# EAGLE design CSv2_exp_board (EAGLE 9.6.2)
COMPANY: ADAFRUIT INDUSTRIES; DRAWN: KTOWN; REV: B

## Sheet 1 of 3
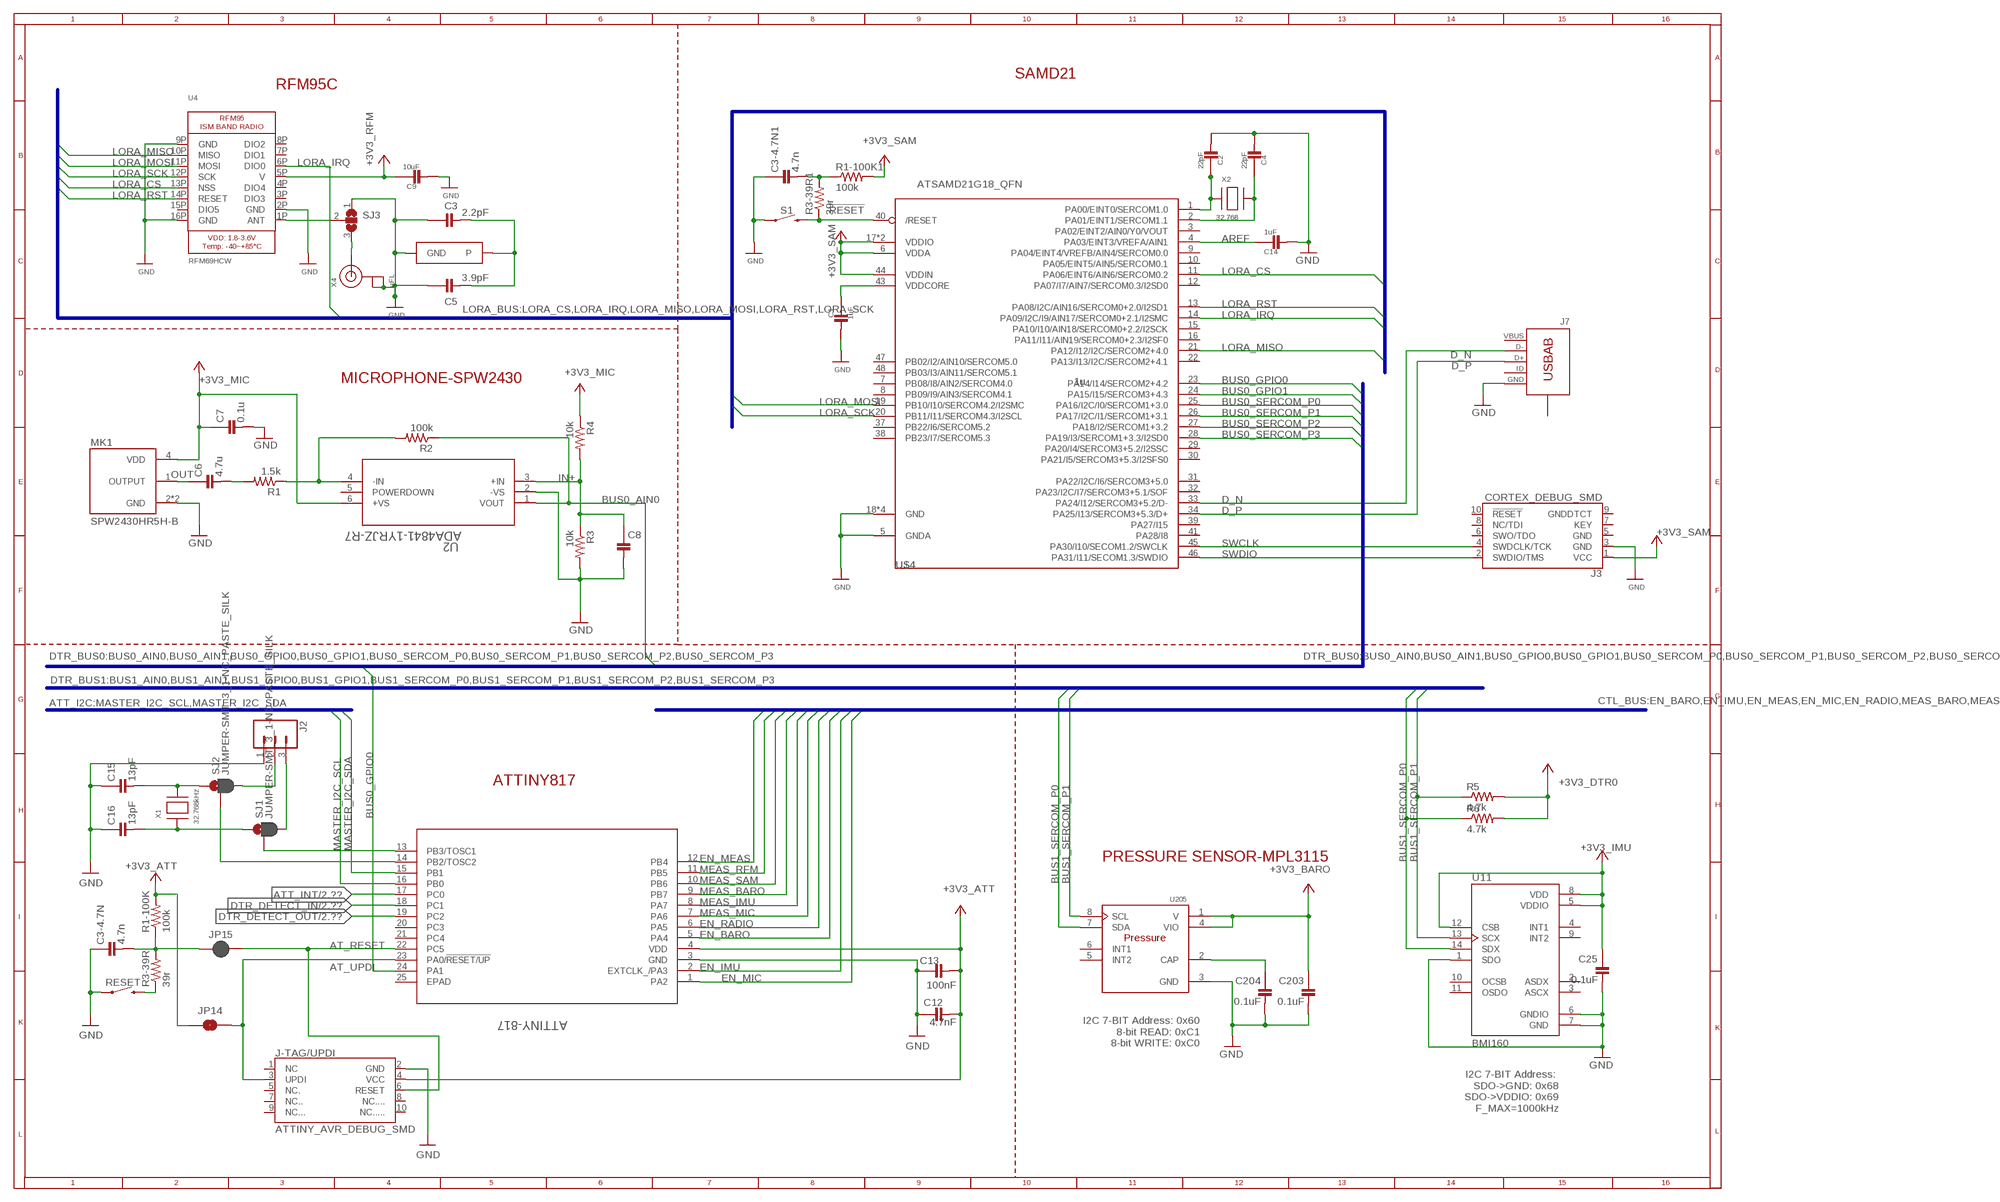
[diagram p0: schematic, sheet 1, part 1 of 2]
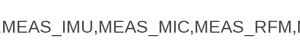
[diagram p1: schematic, sheet 1, part 2 of 2]

### Parts
ATTINY-817  ATTINY817-MFRQFN24_RX4MC-L_ATTINY817-MFR  [ATTINY817-MFRQFN24_RX4MC-L_QFN24_4X4MC]
C1  1uF  C-0603  [C0603]
C2  22pF  C-0603  [C0603]
C3  2.2pF  C-0402  [C0402]
C3-4.7N  4.7n  C-0603  [C0603]
C3-4.7N1  4.7n  C-0603  [C0603]
C4  22pF  C-0603  [C0603]
C5  3.9pF  C-0402  [C0402]
C6  4.7u  C-0603  [C0603]
C7  0.1u  C-0603  [C0603]
C8  1u  C-0603  [C0603]
C9  10uF  C-0805  [C0805]
C12  4.7nF  C-0603  [C0603]
C13  100nF  C-0402  [C0402]
C14  1uF  C-0603  [C0603]
C15  13pF  C-0402  [C0402]
C16  13pF  C-0402  [C0402]
C25  0.1uF  C-0603  [C0603]
C203  0.1uF  C-0603  [C0603]
C204  0.1uF  C-0603  [C0603]
J2  J-SCR-3SL  [SCR-3.5MM-3]
J3  CORTEX_DEBUG_SMD  [SAMTECH_FTSH-105-01]
J7  J-USB-HIROSE-MICRO-USB  [USB-THRU-ZX62D-AB-5P8]
J-TAG/UPDI  ATTINY_AVR_DEBUG_SMD  [ATTINY_AVR_DEBUG]
JP14  JUMPER-SMT_2_NO_PASTEFREE  [SMT-JUMPER_2_NO_PASTEFREE_NO-SILK]
JP15  JUMPER-SMT_2_NC_PASTE  [SMT-JUMPER_2_LG_NC_PASTE_NO-SILK]
MK1  SPW2430HR5H-B  [MIC_SPW2430HR5H-B]
R1  1.5k  R-0603  [R0603]
R1-100K  100k  R-0603  [R0603]
R1-100K1  100k  R-0603  [R0603]
R2  100k  R-0603  [R0603]
R3  10k  R-0603  [R0603]
R3-39R  39r  R-0603  [R0603]
R3-39R1  39r  R-0603  [R0603]
R4  10k  R-0603  [R0603]
R5  4.7k  R-0805  [R0805]
R6  4.7k  R-0805  [R0805]
RESET  MOMENTARY-SWITCH-SPST-SMD-5.2MM  [TACTILE_SWITCH_SMD_5.2MM]
S1  MOMENTARY-SWITCH-SPST-SMD-5.2MM  [TACTILE_SWITCH_SMD_5.2MM]
SJ1  JUMPER-SMT_3_1-NC_PASTE_SILK  [SMT-JUMPER_3_1-NC_PASTE_SILK]
SJ2  JUMPER-SMT_3_1-NC_PASTE_SILK  [SMT-JUMPER_3_1-NC_PASTE_SILK]
SJ3  JUMPER_SJ2W  [JUMPER_SJ_2]
U2  ADA4841-1YRJZ-R7  [RJ_6]
U4  RFM69HCW  RFM95C  [RFM-MOD]
U11  BMI160  [PQFN50P300X250X88-14N]
U205  MPL3115A2  [MPL3115A2_PSON125P300X500X120-8N]
U$1  ILA09_CHIP_ANTENNASMD  [ILA_09_CHIP_ANTENNA]
U$4  ATSAMD21G18_QFN  MICROBUILDER_ATSAMD21J_QFN  [MICROBUILDER_TQFN48_7MM]
X1  32.768kHz  ADAFRUIT2_XTAL-3.2X1.5  [ADAFRUIT2_XTAL3215]
X2  32.768  ADAFRUIT2_XTAL-3.2X1.5  [ADAFRUIT2_XTAL3215]
X4  uFL  J-U.FL  [U.FL]

### Nets
!RESET: R3-39R1.1 S1.3 U$4.40(/RESET)
+3V3_ATT [power]: ATTINY-817.4(VDD) C12.2 C13.2 J-TAG/UPDI.4(VCC) JP14.1 R1-100K.2 ; supply symbol labelled +3V3 ; also sheet 2
+3V3_BARO [power]: C203.1 U205.1(V) U205.4(VIO) ; supply symbol labelled +3V3 ; also sheet 2
+3V3_DTR0 [power]: R5.2 R6.2 ; supply symbol labelled +3V3 ; also sheet 2
+3V3_IMU: C25.1 U11.5(VDDIO) U11.8(VDD) U11.12(CSB) ; supply symbol labelled +3V3 ; also sheet 2
+3V3_MIC: C7.1 MK1.4(VDD) R4.1 U2.6(+VS) ; supply symbol labelled +3V3 ; also sheet 2
+3V3_RFM [power]: C9.1 U4.5P(V) ; supply symbol labelled +3V3 ; also sheet 2
+3V3_SAM: J3.1(VCC) R1-100K1.2 U$4.6(VDDA) U$4.17(VDDIO) U$4.36(VDDIO) U$4.44(VDDIN) ; supply symbol labelled +3V3 ; also sheet 2
AREF: C14.1 U$4.4(PA03/EINT3/VREFA/AIN1)
AT_RESET: ATTINY-817.22(PC5) J-TAG/UPDI.6(RESET) JP15.2
AT_UPDI: ATTINY-817.23(PA0/!RESET/UP) J-TAG/UPDI.3(UPDI) JP14.2
ATT_INT: ATTINY-817.17(PC0) ; also sheet 2
BUS0_AIN0: R2.1 U2.1(VOUT) ; also sheet 2
BUS0_GPIO0: ATTINY-817.24(PA1) U$4.23(PA14/I14/SERCOM2+4.2) ; also sheet 2
BUS0_GPIO1: U$4.24(PA15/I15/SERCOM3+4.3) ; also sheet 2
BUS0_SERCOM_P0: U$4.25(PA16/I2C/I0/SERCOM1+3.0) ; also sheet 2
BUS0_SERCOM_P1: U$4.26(PA17/I2C/I1/SERCOM1+3.1) ; also sheet 2
BUS0_SERCOM_P2: U$4.27(PA18/I2/SERCOM1+3.2) ; also sheet 2
BUS0_SERCOM_P3: U$4.28(PA19/I3/SERCOM1+3.3/I2SD0) ; also sheet 2
BUS1_SERCOM_P0: R6.1 U11.14(SDX) U205.7(SDA) ; also sheet 2
BUS1_SERCOM_P1: R5.1 U11.13(SCX) U205.8(SCL) ; also sheet 2
D_N [diff_pair]: J7.D- U$4.33(PA24/I12/SERCOM3+5.2/D-)
D_P [diff_pair]: J7.D+ U$4.34(PA25/I13/SERCOM3+5.3/D+)
DTR_DETECT_IN: ATTINY-817.18(PC1) ; also sheet 2
DTR_DETECT_OUT: ATTINY-817.19(PC2) ; also sheet 2
EN_BARO: ATTINY-817.5(PA4) ; also sheet 2
EN_IMU: ATTINY-817.2(EXTCLK_/PA3) ; also sheet 2
EN_MEAS: ATTINY-817.12(PB4) ; also sheet 2
EN_MIC: ATTINY-817.1(PA2) ; also sheet 2
EN_RADIO: ATTINY-817.6(PA5) ; also sheet 2
GND: ATTINY-817.3(GND) C1.2 C2.2 C3-4.7N1.1 C3-4.7N.1 C3.1 C4.2 C5.1 C7.2 C8.2 C9.2 C12.1 C13.1 C14.2 C15.1 C16.1 C25.2 C203.2 C204.2 J2.1 J3.3(GND) J7.GND J-TAG/UPDI.2(GND) MK1.2(GND) MK1.3(GND) R3.2 RESET.1 S1.1 SJ3.1 U2.2(-VS) U4.2P(GND) U4.9P(GND) U4.16P(GND) U11.1(SDO) U11.6(GNDIO) U11.7(GND) U205.3(GND) U$1.GND U$4.5(GNDA) U$4.18(GND) U$4.35(GND) U$4.42(GND) U$4.THERMAL(GND) X4.1(GND) X4.2(GND) ; also sheet 2
IN+: C8.1 R3.1 R4.2 U2.3(+IN)
IN-: R1.1 R2.2 U2.4(-IN)
LORA_CS: U4.13P(NSS) U$4.11(PA06/EINT6/AIN6/SERCOM0.2)
LORA_IRQ: U4.6P(DIO0) U$4.14(PA09/I2C/I9/AIN17/SERCOM0+2.1/I2SMC)
LORA_MISO: U4.10P(MISO) U$4.21(PA12/I12/I2C/SERCOM2+4.0)
LORA_MOSI: U4.11P(MOSI) U$4.19(PB10/I10/SERCOM4.2/I2SMC)
LORA_RST: U4.14P(RESET) U$4.13(PA08/I2C/AIN16/SERCOM0+2.0/I2SD1)
LORA_SCK: U4.12P(SCK) U$4.20(PB11/I11/SERCOM4.3/I2SCL)
MASTER_I2C_SCL: ATTINY-817.16(PB0) ; also sheet 2
MASTER_I2C_SDA: ATTINY-817.15(PB1) ; also sheet 2
MEAS_BARO: ATTINY-817.9(PB7) ; also sheet 2
MEAS_IMU: ATTINY-817.8(PA7) ; also sheet 2
MEAS_MIC: ATTINY-817.7(PA6) ; also sheet 2
MEAS_RFM: ATTINY-817.11(PB5) ; also sheet 2
MEAS_SAM: ATTINY-817.10(PB6) ; also sheet 2
N$1: C1.1 U$4.43(VDDCORE)
N$2: SJ3.3 X4.3(SIGNAL)
N$5: C2.1 U$4.1(PA00/EINT0/SERCOM1.0) X2.P$1
N$6: C6.2 R1.2
N$7: C4.1 U$4.2(PA01/EINT1/SERCOM1.1) X2.P$2
N$9: C3-4.7N1.2 R1-100K1.1 R3-39R1.2
N$10: C204.1 U205.2(CAP)
N$12: R3-39R.1 RESET.3
N$18: ATTINY-817.13(PB3/TOSC1) SJ1.2
N$19: ATTINY-817.14(PB2/TOSC2) SJ2.2
N$20: J2.2 SJ2.3
N$21: J2.3 SJ1.3
N$22: C16.2 SJ1.1 X1.P$1
N$23: C15.2 SJ2.1 X1.P$2
N$24: C3-4.7N.2 JP15.1 R1-100K.1 R3-39R.2
N$25: C3.2 C5.2 U$1.P
N$26: SJ3.2 U4.1P(ANT)
OUT: C6.1 MK1.1(OUTPUT)
SWCLK: J3.4(SWDCLK/TCK) U$4.45(PA30/I10/SECOM1.2/SWCLK)
SWDIO: J3.2(SWDIO/TMS) U$4.46(PA31/I11/SECOM1.3/SWDIO)
Unconnected: ATTINY-817.20(PC3) ATTINY-817.21(PC4) ATTINY-817.25(EPAD) J3.5(GND) J3.6(SWO/TDO) J3.7(KEY) J3.8(NC/TDI) J3.9(GNDDTCT) J3.10(!RESET) J7.S1(SHIELD) J7.S2(SHIELD) J7.S3(SHIELD) J7.S4(SHIELD) J7.USBID J7.VBUS J-TAG/UPDI.1(NC) J-TAG/UPDI.5(NC.) J-TAG/UPDI.7(NC..) J-TAG/UPDI.8(NC....) J-TAG/UPDI.9(NC...) J-TAG/UPDI.10(NC.....) U4.3P(DIO3) U4.4P(DIO4) U4.7P(DIO1) U4.8P(DIO2) U4.15P(DIO5) U11.2(ASDX) U11.3(ASCX) U11.4(INT1) U11.9(INT2) U11.10(OCSB) U11.11(OSDO) U205.5(INT2) U205.6(INT1) U$4.3(PA02/EINT2/AIN0/Y0/VOUT) U$4.7(PB08/I8/AIN2/SERCOM4.0) U$4.8(PB09/I9/AIN3/SERCOM4.1) U$4.9(PA04/EINT4/VREFB/AIN4/SERCOM0.0) U$4.10(PA05/EINT5/AIN5/SERCOM0.1) U$4.12(PA07/I7/AIN7/SERCOM0.3/I2SD0) U$4.15(PA10/I10/AIN18/SERCOM0+2.2/I2SCK) U$4.16(PA11/I11/AIN19/SERCOM0+2.3/I2SF0) U$4.22(PA13/I13/I2C/SERCOM2+4.1) U$4.29(PA20/I4/SERCOM3+5.2/I2SSC) U$4.30(PA21/I5/SERCOM3+5.3/I2SFS0) U$4.31(PA22/I2C/I6/SERCOM3+5.0) U$4.32(PA23/I2C/I7/SERCOM3+5.1/SOF) U$4.37(PB22/I6/SERCOM5.2) U$4.38(PB23/I7/SERCOM5.3) U$4.39(PA27/I15) U$4.41(PA28/I8) U$4.47(PB02/I2/AIN10/SERCOM5.0) U$4.48(PB03/I3/AIN11/SERCOM5.1)

### Buses
LORA_BUS:LORA_CS,LORA_IRQ,LORA_MISO,LORA_MOSI,LORA_RST,LORA_SCK
ATT_I2C:MASTER_I2C_SCL,MASTER_I2C_SDA
CTL_BUS:EN_BARO,EN_IMU,EN_MEAS,EN_MIC,EN_RADIO,MEAS_BARO,MEAS_IMU,MEAS_MIC,MEAS_RFM,MEAS_SAM
DTR_BUS0:BUS0_AIN0,BUS0_AIN1,BUS0_GPIO0,BUS0_GPIO1,BUS0_SERCOM_P0,BUS0_SERCOM_P1,BUS0_SERCOM_P2,BUS0_SERCOM_P3
DTR_BUS1:BUS1_AIN0,BUS1_AIN1,BUS1_GPIO0,BUS1_GPIO1,BUS1_SERCOM_P0,BUS1_SERCOM_P1,BUS1_SERCOM_P2,BUS1_SERCOM_P3

### Notes on the sheet
- SAMD21
- RFM95C
- MICROPHONE-SPW2430
- ATTINY817
- PRESSURE SENSOR-MPL3115
- I2C 7-BIT Address: 0x60
        8-bit READ: 0xC1
        8-bit WRITE: 0xC0
- I2C 7-BIT Address: 
  SDO->GND: 0x68
  SDO->VDDIO: 0x69
  F_MAX=1000kHz

## Sheet 2 of 3
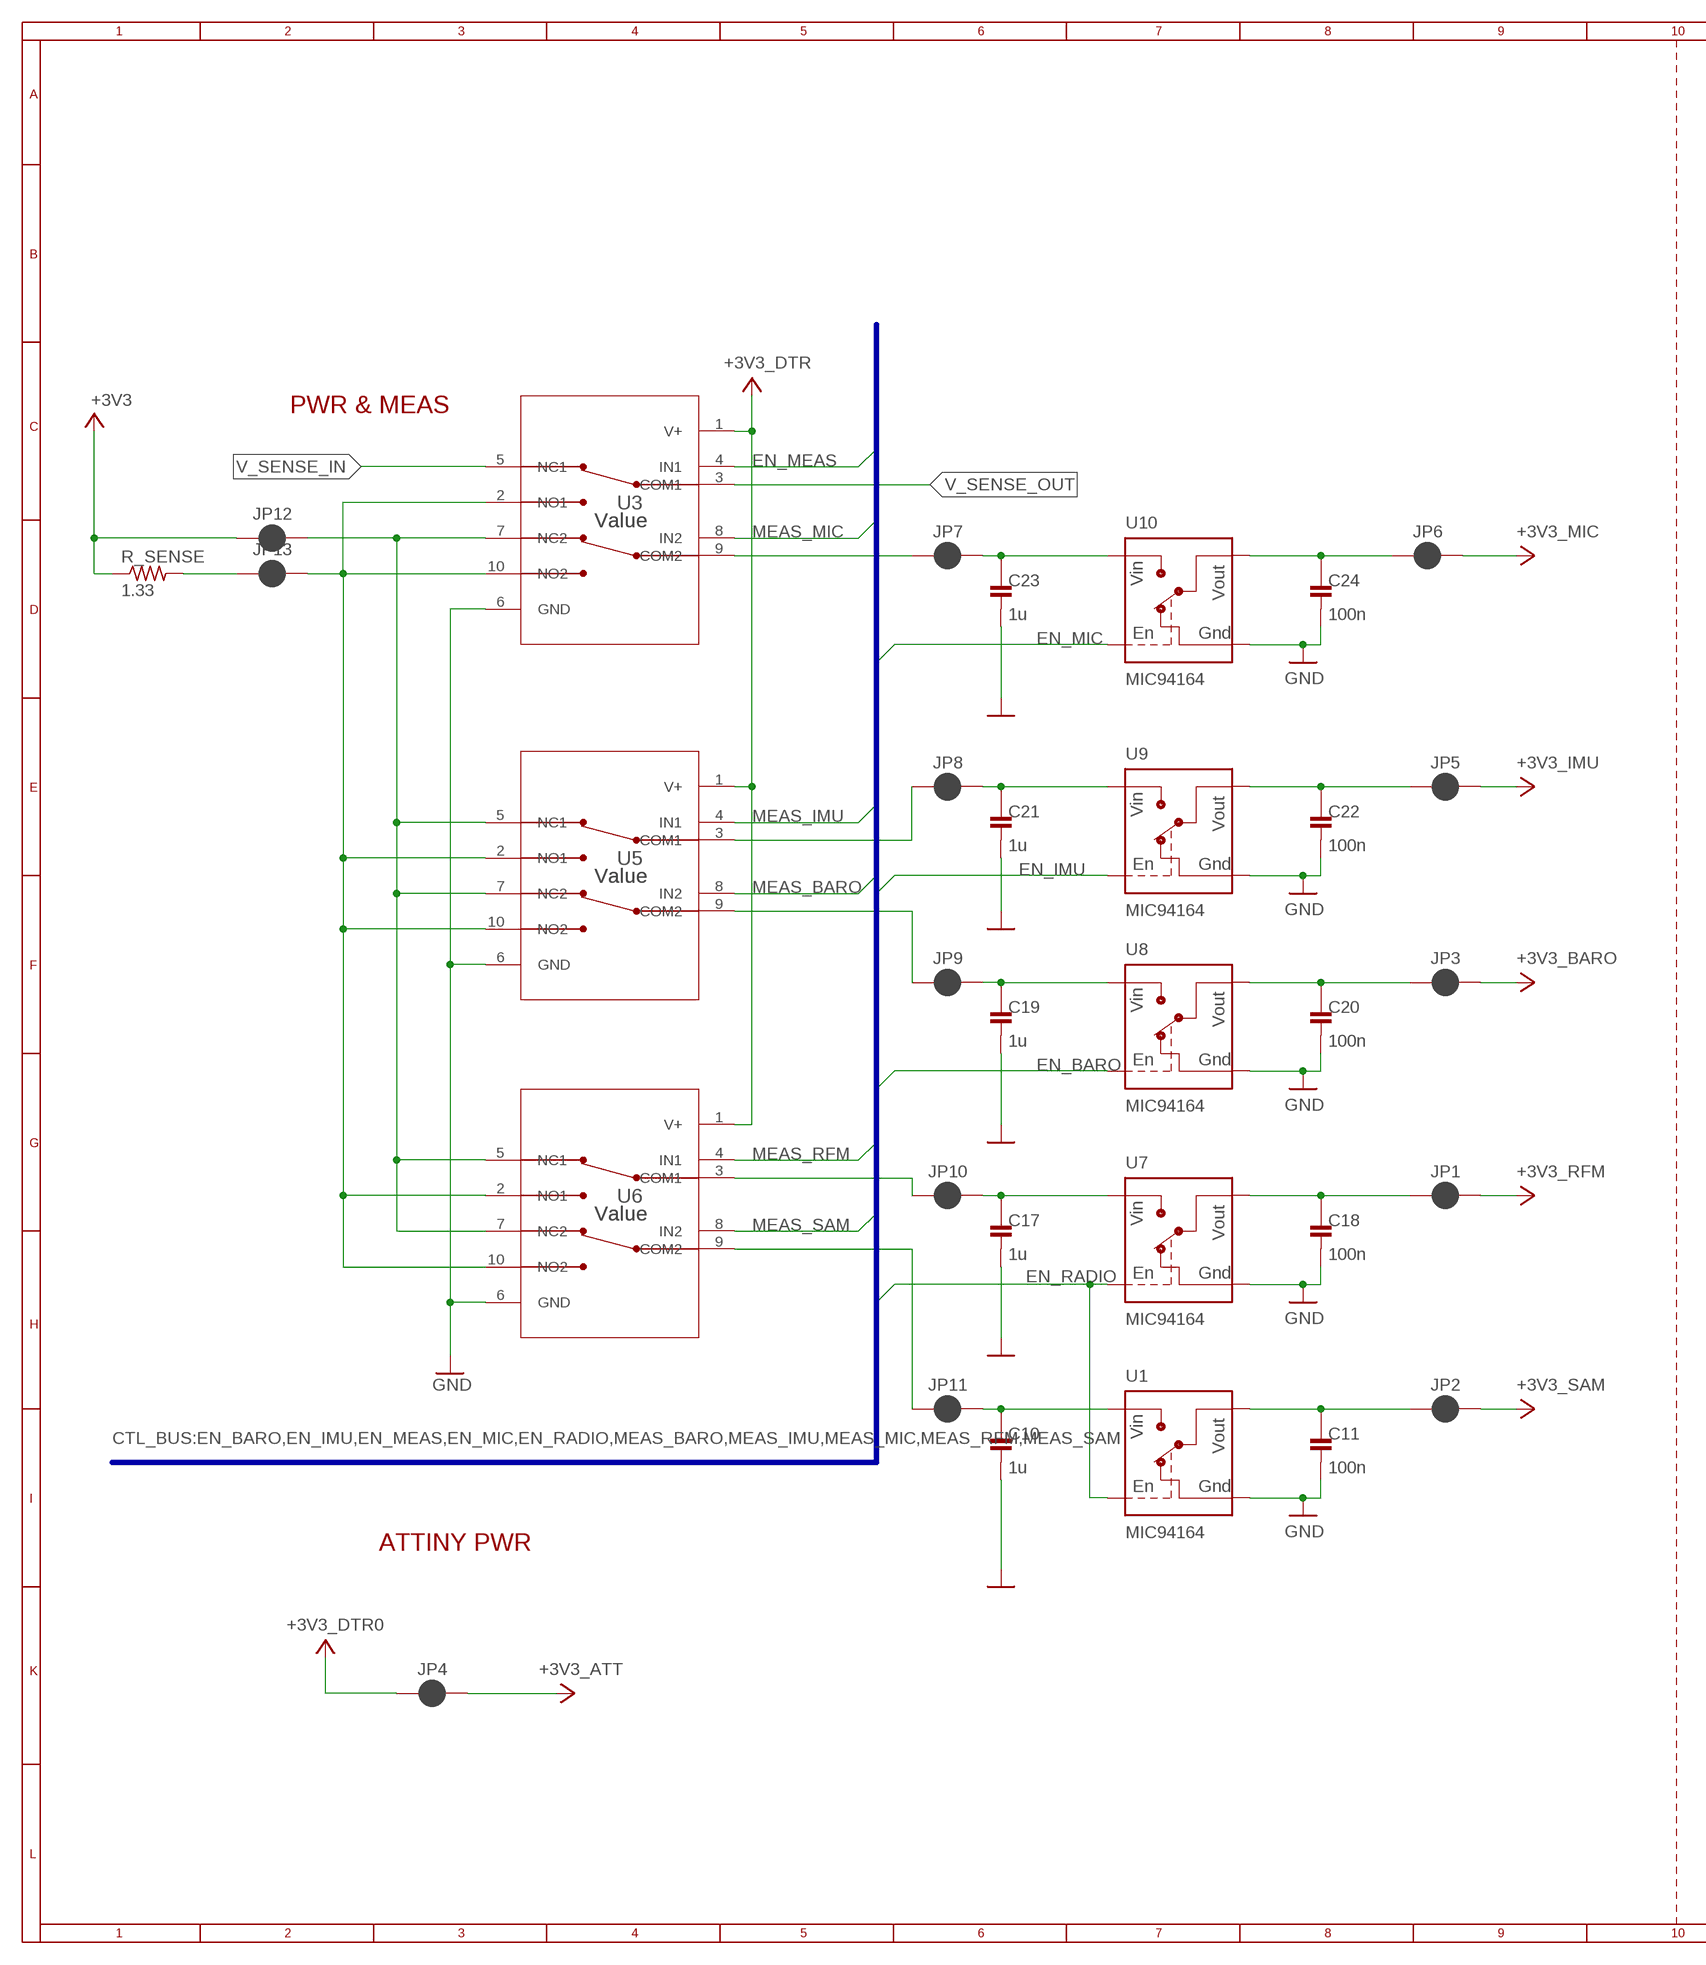
[diagram p2: schematic, sheet 2, part 1 of 2]
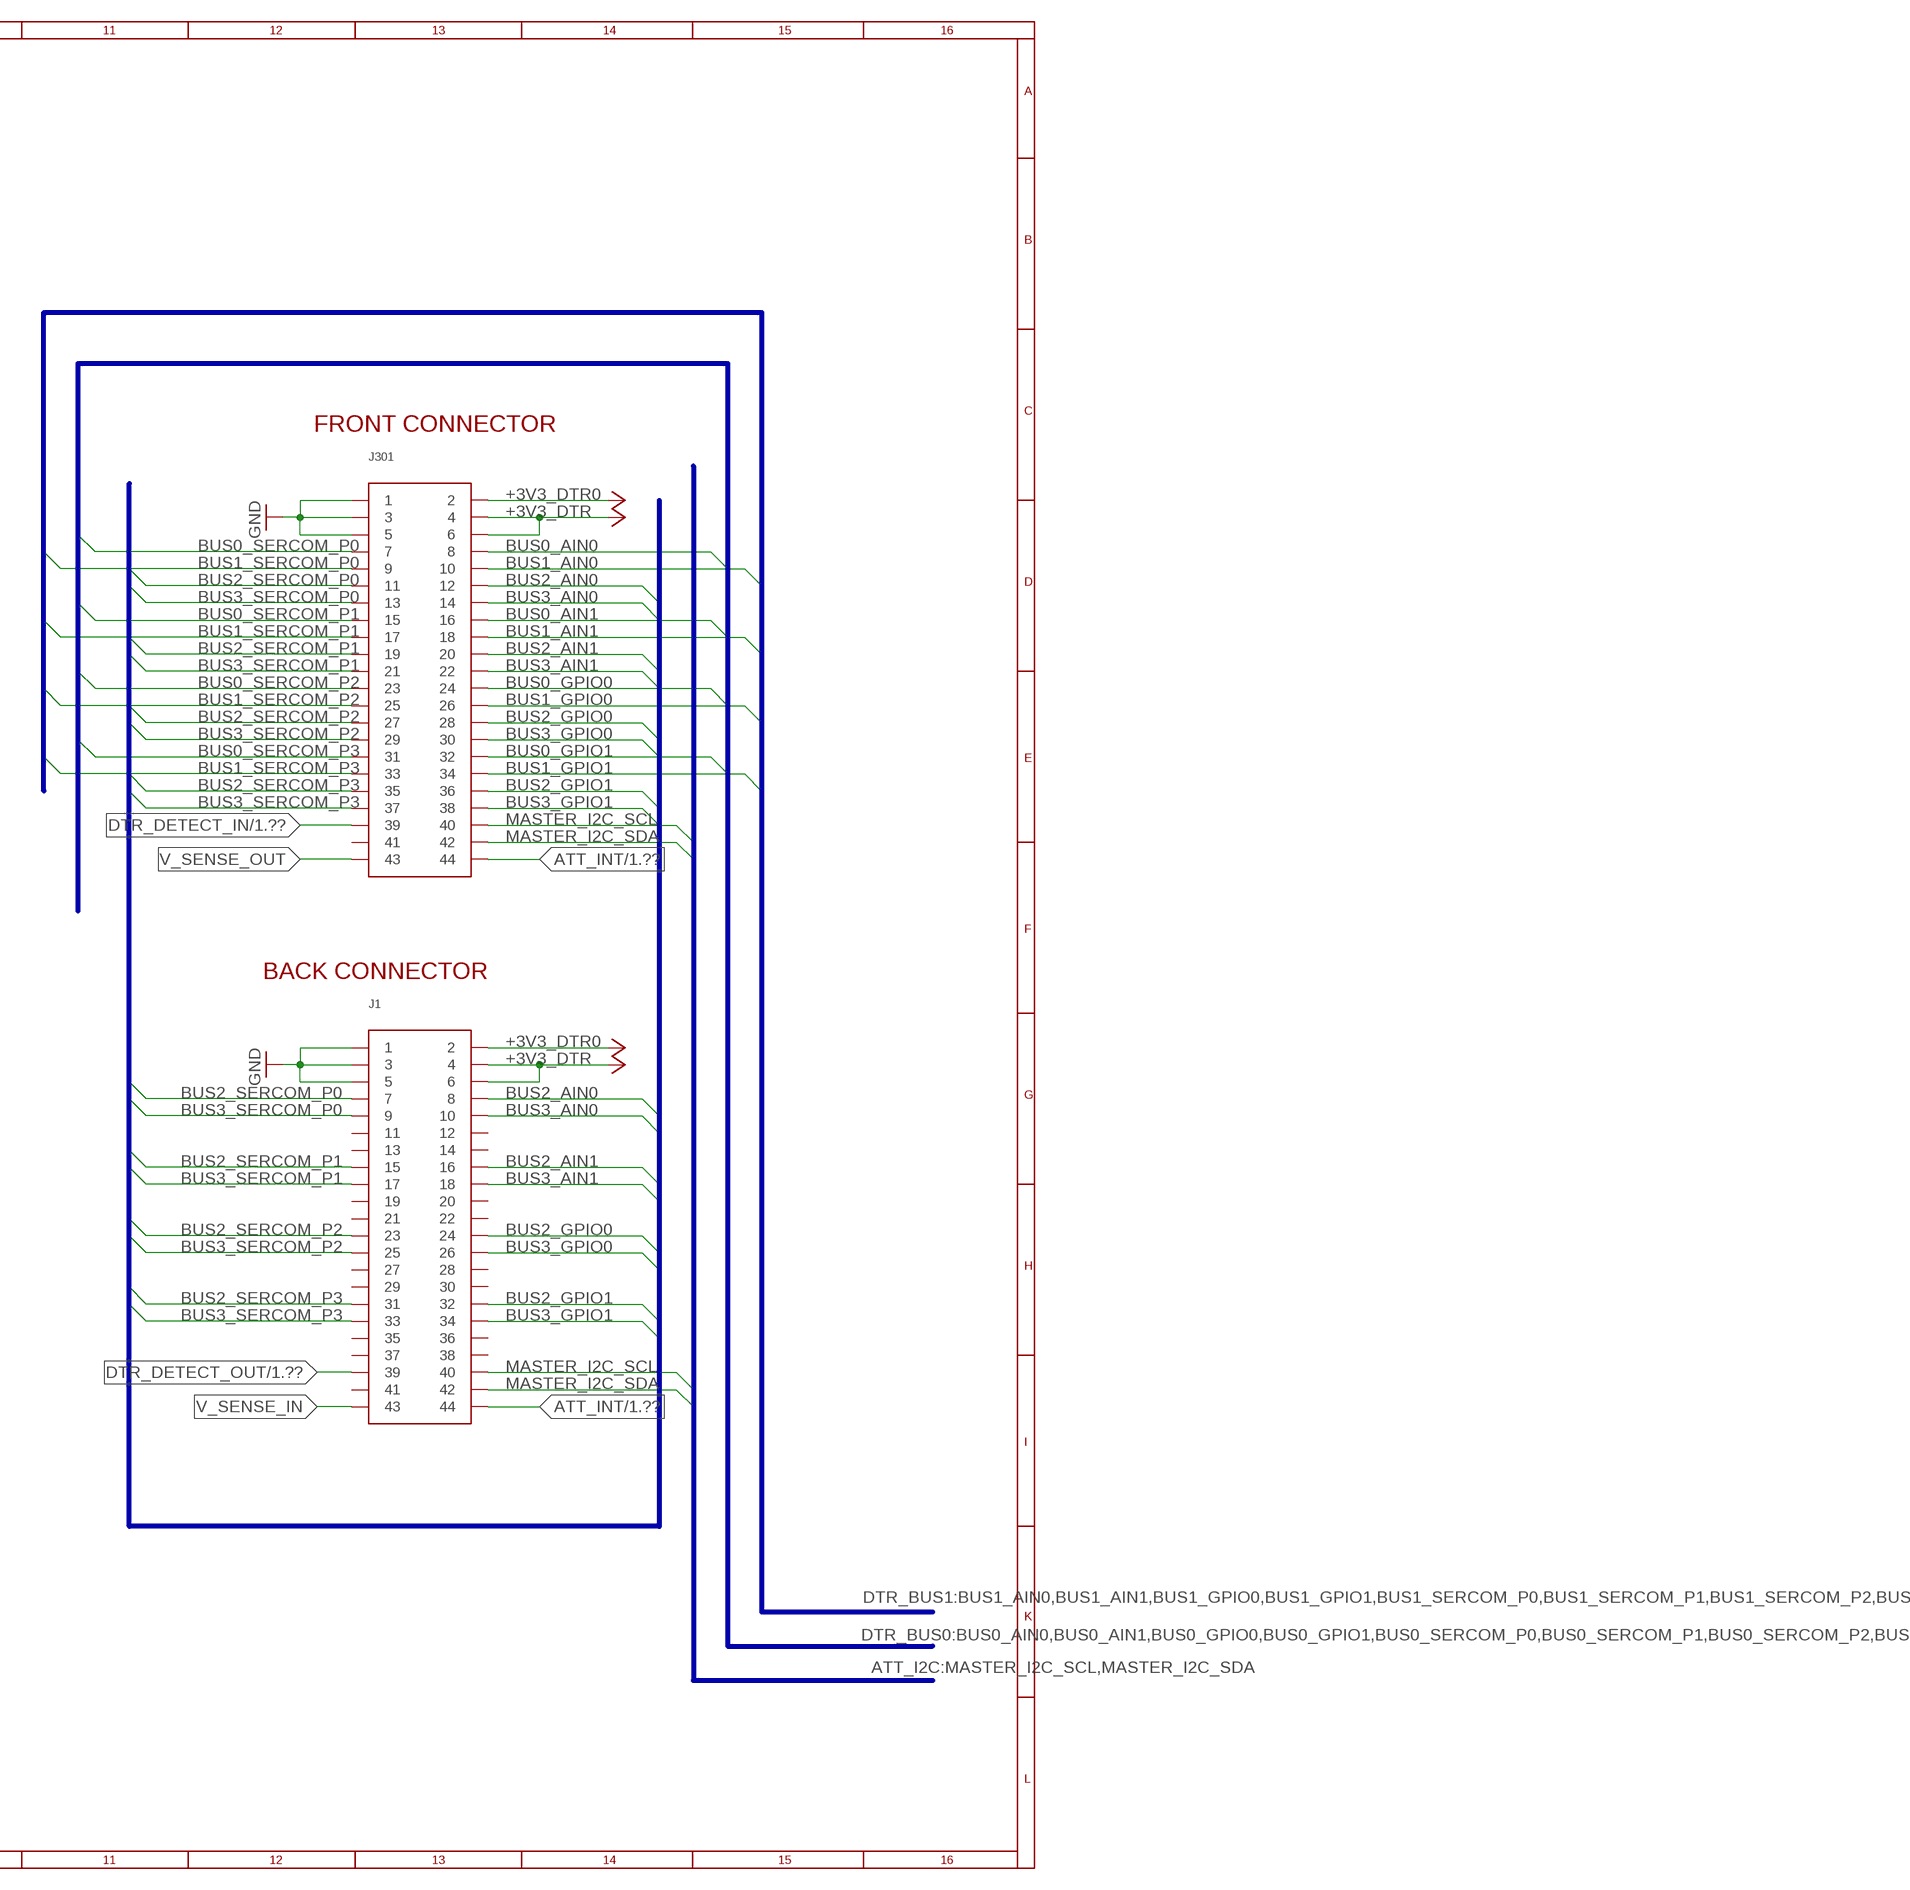
[diagram p3: schematic, sheet 2, part 2 of 2]

### Parts
C10  1u  C-0402  [C0402]
C11  100n  C-0402  [C0402]
C17  1u  C-0402  [C0402]
C18  100n  C-0402  [C0402]
C19  1u  C-0402  [C0402]
C20  100n  C-0402  [C0402]
C21  1u  C-0402  [C0402]
C22  100n  C-0402  [C0402]
C23  1u  C-0402  [C0402]
C24  100n  C-0402  [C0402]
J1  HIROSE-DF40_44-PIN_CONNECTORS-RECEPTACLE  [HRS_DF40HC(3.0)-44DS-0.4V(51)]
J301  HIROSE-DF40_44-PIN_CONNECTORS-RECEPTACLE  [HRS_DF40HC(3.0)-44DS-0.4V(51)]
JP1  JUMPER-SMT_2_NC_PASTE  [SMT-JUMPER_2_LG_NC_PASTE_NO-SILK]
JP2  JUMPER-SMT_2_NC_PASTE  [SMT-JUMPER_2_LG_NC_PASTE_NO-SILK]
JP3  JUMPER-SMT_2_NC_PASTE  [SMT-JUMPER_2_LG_NC_PASTE_NO-SILK]
JP4  JUMPER-SMT_2_NC_PASTE  [SMT-JUMPER_2_LG_NC_PASTE_NO-SILK]
JP5  JUMPER-SMT_2_NC_PASTE  [SMT-JUMPER_2_LG_NC_PASTE_NO-SILK]
JP6  JUMPER-SMT_2_NC_PASTE  [SMT-JUMPER_2_LG_NC_PASTE_NO-SILK]
JP7  JUMPER-SMT_2_NC_PASTE  [SMT-JUMPER_2_LG_NC_PASTE_NO-SILK]
JP8  JUMPER-SMT_2_NC_PASTE  [SMT-JUMPER_2_LG_NC_PASTE_NO-SILK]
JP9  JUMPER-SMT_2_NC_PASTE  [SMT-JUMPER_2_LG_NC_PASTE_NO-SILK]
JP10  JUMPER-SMT_2_NC_PASTE  [SMT-JUMPER_2_LG_NC_PASTE_NO-SILK]
JP11  JUMPER-SMT_2_NC_PASTE  [SMT-JUMPER_2_LG_NC_PASTE_NO-SILK]
JP12  JUMPER-SMT_2_NC_PASTE  [SMT-JUMPER_2_LG_NC_PASTE_NO-SILK]
JP13  JUMPER-SMT_2_NC_PASTE  [SMT-JUMPER_2_LG_NC_PASTE_NO-SILK]
R_SENSE  1.33  R-0603  [R0603]
U1  LOADSWITCH-MIC94164  [WLCSP6_2X3]
U3  Value  TS3A24159DGSRDGS0010A_L  [DGS0010A_L]
U5  Value  TS3A24159DGSRDGS0010A_L  [DGS0010A_L]
U6  Value  TS3A24159DGSRDGS0010A_L  [DGS0010A_L]
U7  LOADSWITCH-MIC94164  [WLCSP6_2X3]
U8  LOADSWITCH-MIC94164  [WLCSP6_2X3]
U9  LOADSWITCH-MIC94164  [WLCSP6_2X3]
U10  LOADSWITCH-MIC94164  [WLCSP6_2X3]

### Nets
3V_LD_SW [power]: C10.1 JP11.2 U1.A2(VIN) U1.B2(VIN)
3V_LD_SW1 [power]: C17.1 JP10.2 U7.A2(VIN) U7.B2(VIN)
3V_LD_SW2 [power]: C19.1 JP9.2 U8.A2(VIN) U8.B2(VIN)
3V_LD_SW3 [power]: C21.1 JP8.2 U9.A2(VIN) U9.B2(VIN)
3V_LD_SW4 [power]: C23.1 JP7.2 U10.A2(VIN) U10.B2(VIN)
+3V3 [power]: JP12.1 R_SENSE.1
+3V3_ATT [power]: JP4.2 ; supply symbol labelled +3V3 ; also sheet 1
+3V3_BARO [power]: JP3.2 ; supply symbol labelled +3V3 ; also sheet 1
+3V3_DTR [power]: J1.4 J1.6 J301.4 J301.6 U3.1(V+) U5.1(V+) U6.1(V+) ; supply symbol labelled +3V3
+3V3_DTR0 [power]: J1.2 J301.2 JP4.1 ; supply symbol labelled +3V3 ; also sheet 1
+3V3_IMU: JP5.2 ; supply symbol labelled +3V3 ; also sheet 1
+3V3_MIC: JP6.2 ; supply symbol labelled +3V3 ; also sheet 1
+3V3_RFM [power]: JP1.2 ; supply symbol labelled +3V3 ; also sheet 1
+3V3_SAM: JP2.2 ; supply symbol labelled +3V3 ; also sheet 1
ATT_INT: J1.44 J301.44 ; also sheet 1
BUS0_AIN0: J301.8 ; also sheet 1
BUS0_AIN1: J301.16
BUS0_GPIO0: J301.24 ; also sheet 1
BUS0_GPIO1: J301.32 ; also sheet 1
BUS0_SERCOM_P0: J301.7 ; also sheet 1
BUS0_SERCOM_P1: J301.15 ; also sheet 1
BUS0_SERCOM_P2: J301.23 ; also sheet 1
BUS0_SERCOM_P3: J301.31 ; also sheet 1
BUS1_AIN0: J301.10
BUS1_AIN1: J301.18
BUS1_GPIO0: J301.26
BUS1_GPIO1: J301.34
BUS1_SERCOM_P0: J301.9 ; also sheet 1
BUS1_SERCOM_P1: J301.17 ; also sheet 1
BUS1_SERCOM_P2: J301.25
BUS1_SERCOM_P3: J301.33
BUS2_AIN0: J1.8 J301.12
BUS2_AIN1: J1.16 J301.20
BUS2_GPIO0: J1.24 J301.28
BUS2_GPIO1: J1.32 J301.36
BUS2_SERCOM_P0: J1.7 J301.11
BUS2_SERCOM_P1: J1.15 J301.19
BUS2_SERCOM_P2: J1.23 J301.27
BUS2_SERCOM_P3: J1.31 J301.35
BUS3_AIN0: J1.10 J301.14
BUS3_AIN1: J1.18 J301.22
BUS3_GPIO0: J1.26 J301.30
BUS3_GPIO1: J1.34 J301.38
BUS3_SERCOM_P0: J1.9 J301.13
BUS3_SERCOM_P1: J1.17 J301.21
BUS3_SERCOM_P2: J1.25 J301.29
BUS3_SERCOM_P3: J1.33 J301.37
DTR_DETECT_IN: J301.39 ; also sheet 1
DTR_DETECT_OUT: J1.39 ; also sheet 1
EN_BARO: U8.C2(ENABLE) ; also sheet 1
EN_IMU: U9.C2(ENABLE) ; also sheet 1
EN_MEAS: U3.4(IN1) ; also sheet 1
EN_MIC: U10.C2(ENABLE) ; also sheet 1
EN_RADIO: U1.C2(ENABLE) U7.C2(ENABLE) ; also sheet 1
GND: C10.2 C11.2 C17.2 C18.2 C19.2 C20.2 C21.2 C22.2 C23.2 C24.2 J1.1 J1.3 J1.5 J301.1 J301.3 J301.5 U1.C1(GND) U3.6(GND) U5.6(GND) U6.6(GND) U7.C1(GND) U8.C1(GND) U9.C1(GND) U10.C1(GND) ; also sheet 1
MASTER_I2C_SCL: J1.40 J301.40 ; also sheet 1
MASTER_I2C_SDA: J1.42 J301.42 ; also sheet 1
MEAS_BARO: U5.8(IN2) ; also sheet 1
MEAS_IMU: U5.4(IN1) ; also sheet 1
MEAS_MIC: U3.8(IN2) ; also sheet 1
MEAS_RFM: U6.4(IN1) ; also sheet 1
MEAS_SAM: U6.8(IN2) ; also sheet 1
N0: C11.1 JP2.1 U1.A1(VOUT) U1.B1(VOUT)
N1: C18.1 JP1.1 U7.A1(VOUT) U7.B1(VOUT)
N2: C20.1 JP3.1 U8.A1(VOUT) U8.B1(VOUT)
N3: C22.1 JP5.1 U9.A1(VOUT) U9.B1(VOUT)
N4: C24.1 JP6.1 U10.A1(VOUT) U10.B1(VOUT)
N$3 [power]: JP7.1 U3.9(COM2)
N$4: JP13.2 U3.2(NO1) U3.10(NO2) U5.2(NO1) U5.10(NO2) U6.2(NO1) U6.10(NO2)
N$8: JP13.1 R_SENSE.2
N$11: JP8.1 U5.3(COM1)
N$13: JP9.1 U5.9(COM2)
N$14: JP10.1 U6.3(COM1)
N$15: JP11.1 U6.9(COM2)
N$16 [power]: JP12.2 U3.7(NC2) U5.5(NC1) U5.7(NC2) U6.5(NC1) U6.7(NC2)
V_SENSE_IN: J1.43 U3.5(NC1)
V_SENSE_OUT: J301.43 U3.3(COM1)
Unconnected: J1.11 J1.12 J1.13 J1.14 J1.19 J1.20 J1.21 J1.22 J1.27 J1.28 J1.29 J1.30 J1.35 J1.36 J1.37 J1.38 J1.41 J301.41

### Buses
BUS2_AIN0,BUS2_AIN1,BUS2_GPIO0,BUS2_GPIO1,BUS2_SERCOM_P0,BUS2_SERCOM_P1,BUS2_SERCOM_P2,BUS2_SERCOM_P3,BUS3_AIN0,BUS3_AIN1,BUS3_GPIO0,BUS3_GPIO1,BUS3_SERCOM_P0,BUS3_SERCOM_P1,BUS3_SERCOM_P2,BUS3_SERCOM_P3
CTL_BUS:EN_BARO,EN_IMU,EN_MEAS,EN_MIC,EN_RADIO,MEAS_BARO,MEAS_IMU,MEAS_MIC,MEAS_RFM,MEAS_SAM
DTR_BUS1:BUS1_AIN0,BUS1_AIN1,BUS1_GPIO0,BUS1_GPIO1,BUS1_SERCOM_P0,BUS1_SERCOM_P1,BUS1_SERCOM_P2,BUS1_SERCOM_P3
DTR_BUS0:BUS0_AIN0,BUS0_AIN1,BUS0_GPIO0,BUS0_GPIO1,BUS0_SERCOM_P0,BUS0_SERCOM_P1,BUS0_SERCOM_P2,BUS0_SERCOM_P3
ATT_I2C:MASTER_I2C_SCL,MASTER_I2C_SDA

### Notes on the sheet
- PWR & MEAS
- FRONT CONNECTOR
- BACK CONNECTOR
- ATTINY PWR

## Sheet 3 of 3

## Power pins joined to a net without a drawn wire
POWERDOWN: U2.5(POWERDOWN)

## Library data of the parts
ATTINY-817 = CommonSense-DTR-v1:ATTINY817-MFRQFN24_RX4MC-L_ATTINY817-MFR; MANUFACTURER_PART_NUMBER: ATTINY817MFR; VENDOR: Microchip
C1-C3 C3-4.7N C3-4.7N1 C4-C9 C14-C16 C25 C203 C204 = Capacitors:C-: Capacitor, Surface Mount; MANUFACTURER: Kemet; TC: X7R; TOL: 10%; VOLTAGE: 6.3V
C10 C12 C13 C17 C19 C21 C23 = Capacitors:C-: Capacitor, Surface Mount; MANUFACTURER: Kemet; PARTNO: CC0402KRX5R5BB105; TC: X7R; TOL: 10%; VOLTAGE: 6.3V
C11 C18 C20 C22 C24 = Capacitors:C-: Capacitor, Surface Mount; MANUFACTURER: Kemet; PARTNO: CC0402KRX5R5BB104; TC: X7R; TOL: 10%; VOLTAGE: 6.3V
J1 J301 = Connectors:HIROSE-DF40_44-PIN_CONNECTORS: Hirose DF40 series 44-pin mezzanine type connectors at 0.4mm pitch. Specification and Variants: https://www.hirose.com/product/document?clcode=&productname=&series=DF40&documenttype=Catalog&lang=en&documentid=D31649_en; PART_NO: DF40HC(3.0)-44DS-0.4V(51)
J2 = Connectors:J-SCR-3: 3 pin Screw Terminal; MANUFACTURER: On Shore Technologies, Inc.; MPN: OSTTE030161
J3 = Debuggers:CORTEX_DEBUG: Cortex Debug Connector - 10 pin Supports JTAG debug, Serial Wire debug, and Serial Wire Viewer. PTH and SMD connector options available. General Connector Information <http://infocenter.arm.com/help/topic/com.arm.doc.faqs/attached/13634/cortex_debug_connectors.pdf> Products: PTH Connector <http://www.digikey.com/product-detail/en/cnc-tech/3220-10-0100-00/1175-1627-ND/3883661> -via Digi-Key SparkFun PSoc <https://www.sparkfun.com/products/13229> SparkFun T <https://www.sparkfun.com/products/13810>
J7 = Connectors:J-USB-HIROSE-MICRO-USB: USB - Hirose ZX62D-AB-5P8(30) micro AB USB 2.0 Receptacle Connector 5 Position Surface Mount, Right Angle; Through Hole Because this component has through-hole tabs, it is much less susceptible to being ripped off of the board!; MANUFACTURER: Hirose; MPN: ZX62D-AB-5P8(30)
J-TAG/UPDI = CommonSense-DTR-v1:ATTINY_AVR_DEBUG: Cortex Debug Connector - 10 pin Supports JTAG debug, Serial Wire debug, and Serial Wire Viewer. PTH and SMD connector options available. General Connector Information <http://infocenter.arm.com/help/topic/com.arm.doc.faqs/attached/13634/cortex_debug_connectors.pdf> Products: PTH Connector <http://www.digikey.com/product-detail/en/cnc-tech/3220-10-0100-00/1175-1627-ND/3883661> -via Digi-Key SparkFun PSoc <https://www.sparkfun.com/products/13229> SparkFun T <https://www.sparkfun.com/products/13810>; MANUFACTURER: Samtech Inc.; MPN: FTSH-105-01-L-DV-K-TR; SPICEPREFIX: X
JP1-JP13 JP15 = Connectors:JUMPER-SMT_2_NC_PASTE: Normally closed solder jumper This jumper has an aperture in the stencil to allow solder paste to bridge the split in the wire so it's normally closed (NC). Wick off the solder to open the connection. Reapply solder to reclose the connection.
JP14 = Connectors:JUMPER-SMT_2_NO_PASTEFREE: Normally open solder jumper This jumper has an aperture in the stencil to allow solder paste to bridge the split in the wire but it is normally open (NC). Apply solder to close the connection.
MK1 = SPW2430HR5H-B:SPW2430HR5H-B: Mic Mems Analog; AVAILABILITY: Unavailable; DESCRIPTION: Mic Mems Analog; MF: Knowles; MP: SPW2430HR5H-B; OC_NEWARK: unknown; PACKAGE: Knowles; PRICE: None
R1 R3 R4 = Resistors:R-: Resistor, Surface Mount; MANUFACTURER: Panasonic; OC_NEWARK: unknown; TOL: 5%
R1-100K R1-100K1 R3-39R R3-39R1 R5 R6 = Resistors:R-: Resistor, Surface Mount; MANUFACTURER: Panasonic; TOL: 5%
R2 = Resistors:R-: Resistor, Surface Mount; MANUFACTURER: Panasonic; MF: BOURNS; MPN: 3549S-1AA-102A; OC_NEWARK: 17M3640; TOL: 5%
R_SENSE = Resistors:R-: Resistor, Surface Mount; MANUFACTURER: Panasonic; PARTNO: CRCW06031R33FKEA; TOL: 5%
RESET S1 = Switches:MOMENTARY-SWITCH-SPST: Momentary Switch (Pushbutton) - SPST Normally-open (NO) SPST momentary switches (buttons, pushbuttons). Variants PTH-12MM - 12mm square, through-hole Momentary Pushbutton Switch - 12mm Square <https://www.sparkfun.com/products/9190> (COM-09190) PTH-6.0MM, PTH-6.0MM-KIT - 6.0mm square, through-hole Mini Pushbutton Switch <https://www.sparkfun.com/products/97> (COM-00097) KIT package intended for soldering kit's - only one side of pads' copper is exposed. PTH-RIGHT-ANGLE-KIT - Right-angle, through-hole Right Angle Tactile Button <https://www.sparkfun.com/products/10791> - Used on SparkFun BigTime Watch Kit <https://www.sparkfun.com/products/11734> SMD-12MM - 12mm square, surface-mount Tactile Button - SMD (12mm) <https://www.sparkfun.com/products/12993> (COM-12993) Used on SparkFun PicoBoard <https://www.sparkfun.com/products/11888> SMD-4.5MM - 4.5mm Square Trackball Switch Used on SparkFun Blackberry Trackballer Breakout <https://www.sparkfun.com/products/13169> SMD-4.6MMX2.8MM - 4.60mm x 2.80mm, surface mount Used on SparkFun SAMD21 Mini Breakout <https://www.sparkfun.com/products/13664> SMD-5.2MM, SMD-5.2-REDUNDANT - 5.2mm square, surface-mount Mini Pushbutton Switch - SMD <https://www.sparkfun.com/products/8720> (COM-08720) Used on Arduino Pro Mini <https://www.sparkfun.com/products/11114> REDUNDANT package connects both switch circuits together SMD-6.0X3.5MM - 6.0 x 3.5mm, surface mount Momentary Reset Switch SMD <https://www.sparkfun.com/products/8229> (COM-08229) SMD-6.2MM-TALL - 6.2mm square, surface mount Tactile Button - SMD (6mm) <https://www.sparkfun.com/products/12992> Used on SparkFun Digital Sandbox <https://www.sparkfun.com/products/12651> SMD-RIGHT-ANGLE - Right-angle, surface mount Used on SparkFun Block for Intel® Edison - Arduino <https://www.sparkfun.com/products/13036>; PROD_ID: COMP-12265; SF_SKU: COM-12993
SJ1 SJ2 = Connectors:JUMPER-SMT_3_1-NC_PASTE: Normally closed solder jumper (1 of 2 connections) This jumper has an aperture in the stencil to allow solder paste to bridge one of the two connections. One connection is normally closed (NC), while the other is normally open (NO). Wick off the solder to open the connection. Reapply solder to reclose the connection. Apply solder to the other side instead to change the current path.
SJ3 = CommonSense-DTR-v1:JUMPER_SJ2W: SMD solder JUMPER
U1 U7-U10 = Switches:LOADSWITCH-MIC9416: Micrel 3A High-side Load Switch with Reverse Blocking http://ww1.microchip.com/downloads/en/DeviceDoc/MIC9416x.pdf https://www.digikey.com/product-detail/en/microchip-technology/MIC94162YCS-TR/576-4508-1-ND/4732487; MANUFACTURER: Microchip Technology; MPN: MIC94164YCS-TR; PART_NUMBER: MIC94164; QUENCH: YES; SOFTSTART: YES
U2 = ADA1484:ADA4841-1YRJZ-R7; MANUFACTURER_PART_NUMBER: ADA48411YRJZR7; OC_NEWARK: unknown; SPICEMODEL: ADA4841; SPICEPREFIX: X; VENDOR: Analog Devices Inc
U3 U5 U6 = CommonSense-DTR-v1:TS3A24159DGSR; APPLICATION_BUILDNUMBER: *; COMPTYPE: IC; MANUFACTURER: Texas Instruments; MOUNTTYPE: SMT; PACKAGEREFERENCE: DGS0010A; PARTNUMBER: TS3A24159DGSR; PIN_COUNT: 10; REFDES: RefDes; ROHS: Y; TYPE: TYPE
U4 = Radios:RFM95: RFM95 - ISM Band LoRa Transceiver; FCC: 2ASEORFM95C; MANUFACTURER: HopeRF; MPN: RFM95C
U11 = CommonSense-DTR-v1:BMI160: BMI160 2.5 x 3 mm Tiaxial Accelerometer / Gyroscope Inertial Measurement Unit; AVAILABILITY: Unavailable; DESCRIPTION: Accelerometer, Gyroscope, 6 Axis Sensor I²C, SPI Output; DIGIKEY-PURCHASE-URL: https://snapeda.com/shop?store=DigiKey&id=104926; MF: Bosch; MP: BMI160; PACKAGE: LGA-14 Bosch; PRICE: None
U205 = Sensors:MPL3115A2: Pressure Sensor, 50-110kpa, Lga-8; DESCRIPTION: Pressure Sensor, 50-110kpa, Lga-8; DIGI-KEY_PART_NUMBER: MPL3115A2-ND; DIGI-KEY_PURCHASE_URL: https://www.digikey.com/product-detail/en/nxp-usa-inc/MPL3115A2/MPL3115A2-ND/2817529?utm_source=snapeda&utm_medium=aggregator&utm_campaign=symbol; MANUFACTURER: NXP; MF: NXP USA; MP: MPL3115A2; MPN: MPL-3115A2; PACKAGE: LGA-8 NXP USA
U$1 = CommonSense-DTR-v1:ILA09_CHIP_ANTENNA
U$4 = CommonSense-DTR-v1:MICROBUILDER_ATSAMD21J
X1 X2 = CommonSense-DTR-v1:ADAFRUIT2_XTAL: Low cost SMT crystals, no capacitors included http://www.ladyada.net/library/eagle
X4 = Connectors:J-U.FL: U.FL Antenna Connector

## Net classes
0 default: width 0.127 mm, drill 0.254 mm
1 power: width 0.229 mm, drill 0.254 mm
2 diff_pair: width 0.406 mm
8 GND: width 0.127 mm

## Board
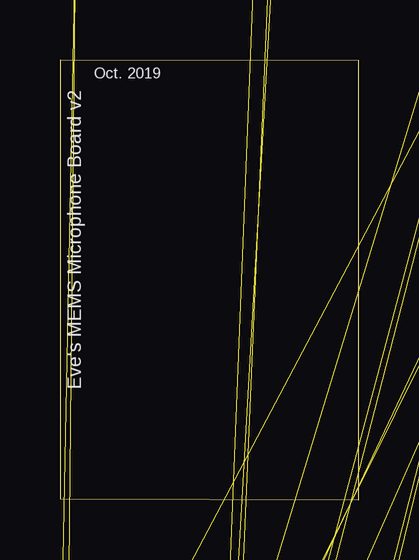
[diagram p4: board, top side]
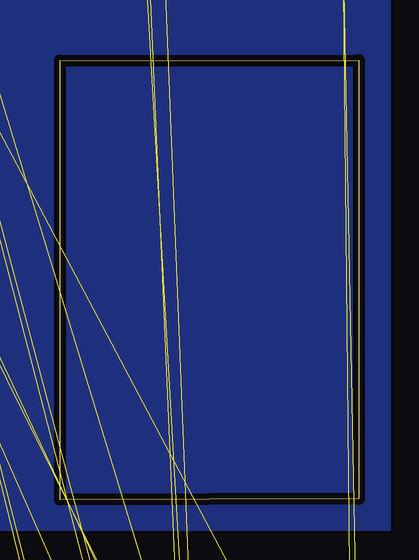
[diagram p5: board, bottom side, seen from below]

Size 12.45 x 18.31 mm. Coordinates in mm from the lower left corner, seen from the top.
Outline: 0,0.03 12.45,0 12.45,18.29 0,18.31 0,0.03
Copper layers (1*16): Top 0.035mm / dielectric 1.5mm / Bottom 0.035mm
Design rules "adafruit *": minimum track width 8mil, minimum drill 15.5mil, track to track 8mil, track to pad 8mil, pad to pad 8mil, via to via 8mil, smd to smd 8mil, copper to edge 10mil, drill to drill 8mil, minimum pad ring 10mil, minimum via ring 8mil, stop-mask expansion 2mil, vias tented up to drill 20mil, thermal gap 10mil
tRestrict: area 67.1,236.8 to 67.4,239.5; area 67.8,242 to 72.8,242.3; area 72.3,239.5 to 72.8,242.1

### Footprints (pad centres in the part's own frame; a part is rotated, then mirrored left to right if it is on the bottom)
ATTINY817-MFRQFN24_RX4MC-L_QFN24_4X4MC = smd 0.813 x 0.203: 1 -1.968,1.27; 2 -1.968,0.762; 3 -1.968,0.254; 4 -1.968,-0.254; 5 -1.968,-0.762; 6 -1.968,-1.27; 13 1.968,-1.27; 14 1.968,-0.762; 15 1.968,-0.254; 16 1.968,0.254; 17 1.968,0.762; 18 1.968,1.27 | smd 0.203 x 0.813: 7 -1.27,-1.968; 8 -0.762,-1.968; 9 -0.254,-1.968; 10 0.254,-1.968; 11 0.762,-1.968; 12 1.27,-1.968; 19 1.27,1.968; 20 0.762,1.968; 21 0.254,1.968; 22 -0.254,1.968; 23 -0.762,1.968; 24 -1.27,1.968 | smd 2.591 x 2.591: 25 0,0
C0603 = smd 0.95 x 1: 1 -0.8,0; 2 0.8,0
C0402 = smd 0.62 x 0.62: 1 -0.45,0; 2 0.45,0
C0805 = smd 1.15 x 1.45: 1 -0.9,0; 2 0.9,0
HRS_DF40HC(3.0)-44DS-0.4V(51) = smd 0.2 x 1.14: 1 -4.2,-1.32; 2 -4.2,1.32; 3 -3.8,-1.32; 4 -3.8,1.32; 5 -3.4,-1.32; 6 -3.4,1.32; 7 -3,-1.32; 8 -3,1.32; 9 -2.6,-1.32; 10 -2.6,1.32; 11 -2.2,-1.32; 12 -2.2,1.32; 13 -1.8,-1.32; 14 -1.8,1.32; 15 -1.4,-1.32; 16 -1.4,1.32; 17 -1,-1.32; 18 -1,1.32; 19 -0.6,-1.32; 20 -0.6,1.32; 21 -0.2,-1.32; 22 -0.2,1.32; 23 0.2,-1.32; 24 0.2,1.32; 25 0.6,-1.32; 26 0.6,1.32; 27 1,-1.32; 28 1,1.32; 29 1.4,-1.32; 30 1.4,1.32; 31 1.8,-1.32; 32 1.8,1.32; 33 2.2,-1.32; 34 2.2,1.32; 35 2.6,-1.32; 36 2.6,1.32; 37 3,-1.32; 38 3,1.32; 39 3.4,-1.32; 40 3.4,1.32; 41 3.8,-1.32; 42 3.8,1.32; 43 4.2,-1.32; 44 4.2,1.32
SCR-3.5MM-3 = drill 1.2 pad 2.032 square: 1 0,0 | drill 1.2 pad 2.032: 2 3.5,0; 3 7,0
SAMTECH_FTSH-105-01 = smd 0.508 x 1.27: 1 -2.54,-2.413; 2 -2.54,2.413; 3 -1.27,-2.413; 4 -1.27,2.413; 5 0,-2.413; 6 0,2.413; 7 1.27,-2.413; 8 1.27,2.413; 9 2.54,-2.413; 10 2.54,2.413
USB-THRU-ZX62D-AB-5P8 = smd 1.35 x 0.4: D+ 2.8,0; D- 2.8,0.65; GND 2.8,-1.3; USBID 2.8,-0.65; VBUS 2.8,1.3 | drill 1.25 pad 1.9: S1 0,-4.5; S2 0,4.5 | drill 0.65 pad 1.05: S3 3.125,2.225; S4 3.125,-2.225
ATTINY_AVR_DEBUG = smd 0.508 x 1.27: 1 -2.54,-2.413; 2 -2.54,2.413; 3 -1.27,-2.413; 4 -1.27,2.413; 5 0,-2.413; 6 0,2.413; 7 1.27,-2.413; 8 1.27,2.413; 9 2.54,-2.413; 10 2.54,2.413
SMT-JUMPER_2_LG_NC_PASTE_NO-SILK = smd 0.762 x 1.27: 1 -0.483,0; 2 0.483,0
SMT-JUMPER_2_NO_PASTEFREE_NO-SILK = smd 0.635 x 1.27: 1 -0.406,0; 2 0.406,0
MIC_SPW2430HR5H-B = smd 0.9 x 0.66: 1 -0.675,1.095; 2 -0.675,-1.095; 3 0.675,-1.095; 4 0.675,1.095
R0603 = smd 0.8 x 0.8: 1 -0.75,0; 2 0.75,0
R0805 = smd 0.9 x 1.3: 1 -0.95,0; 2 0.95,0
TACTILE_SWITCH_SMD_5.2MM = smd 1.524 x 0.762: 1 -2.794,1.905; 2 2.794,1.905; 3 -2.794,-1.905; 4 2.794,-1.905
SMT-JUMPER_3_1-NC_PASTE_SILK = smd 0.635 x 1.27: 1 -0.813,0; 2 0,0; 3 0.813,0
JUMPER_SJ_2 = smd 1.168 x 1.6: 1 -1.524,0; 2 0,0; 3 1.524,0
WLCSP6_2X3 = smd 0.254 x 0.254: A1 -0.25,0.5; A2 0.25,0.5; B1 -0.25,0; B2 0.25,0; C1 -0.25,-0.5; C2 0.25,-0.5
RJ_6 = smd 1.511 x 0.531: 1 -1.1,0.95; 2 -1.1,0; 3 -1.1,-0.95; 4 1.1,-0.95; 5 1.1,0; 6 1.1,0.95
DGS0010A_L = smd 1.45 x 0.25: 1 -2.025,1; 2 -2.025,0.5; 3 -2.025,0; 4 -2.025,-0.5; 5 -2.025,-1; 6 2.025,-1; 7 2.025,-0.5; 8 2.025,0; 9 2.025,0.5; 10 2.025,1
RFM-MOD = smd 2 x 0.8: 1P 8.1,-7; 2P 8.1,-5; 3P 8.1,-3; 4P 8.1,-1; 5P 8.1,1; 6P 8.1,3; 7P 8.1,5; 8P 8.1,7; 9P -8.1,7; 10P -8.1,5; 11P -8.1,3; 12P -8.1,1; 13P -8.1,-1; 14P -8.1,-3; 15P -8.1,-5; 16P -8.1,-7
PQFN50P300X250X88-14N = smd 0.59 x 0.35: 1 -1.165,0.75; 2 -1.165,0.25; 3 -1.165,-0.25; 4 -1.165,-0.75; 8 1.165,-0.75; 9 1.165,-0.25; 10 1.165,0.25; 11 1.165,0.75 | smd 0.35 x 0.59: 5 -0.5,-0.915; 6 0,-0.915; 7 0.5,-0.915; 12 0.5,0.915; 13 0,0.915; 14 -0.5,0.915
MPL3115A2_PSON125P300X500X120-8N = smd 0.9 x 0.55: 1 -1,1.875; 2 -1,0.625; 3 -1,-0.625; 4 -1,-1.875; 5 1,-1.875; 6 1,-0.625; 7 1,0.625; 8 1,1.875
ILA_09_CHIP_ANTENNA = smd 0.7 x 3: GND -2.5,0; P 2.5,0 | smd 0.75 x 2.5: NC 0,0
MICROBUILDER_TQFN48_7MM = smd 0.25 x 0.75: 1 -2.75,-3.475; 2 -2.25,-3.475; 3 -1.75,-3.475; 4 -1.25,-3.475; 5 -0.75,-3.475; 6 -0.25,-3.475; 7 0.25,-3.475; 8 0.75,-3.475; 9 1.25,-3.475; 10 1.75,-3.475; 11 2.25,-3.475; 12 2.75,-3.475; 25 2.75,3.475; 26 2.25,3.475; 27 1.75,3.475; 28 1.25,3.475; 29 0.75,3.475; 30 0.25,3.475; 31 -0.25,3.475; 32 -0.75,3.475; 33 -1.25,3.475; 34 -1.75,3.475; 35 -2.25,3.475; 36 -2.75,3.475 | smd 0.75 x 0.25: 13 3.475,-2.75; 14 3.475,-2.25; 15 3.475,-1.75; 16 3.475,-1.25; 17 3.475,-0.75; 18 3.475,-0.25; 19 3.475,0.25; 20 3.475,0.75; 21 3.475,1.25; 22 3.475,1.75; 23 3.475,2.25; 24 3.475,2.75; 37 -3.475,2.75; 38 -3.475,2.25; 39 -3.475,1.75; 40 -3.475,1.25; 41 -3.475,0.75; 42 -3.475,0.25; 43 -3.475,-0.25; 44 -3.475,-0.75; 45 -3.475,-1.25; 46 -3.475,-1.75; 47 -3.475,-2.25; 48 -3.475,-2.75 | smd 4.7 x 4.7: THERMAL 0,0
ADAFRUIT2_XTAL3215 = smd 1.1 x 1.9: P$1 1.2,0; P$2 -1.2,0
U.FL = smd 2.2 x 1.05: 1 0,1.375; 2 0,-1.375 | smd 0.8 x 1: 3 1.525,0

### Placement (x,y rotation side)
ATTINY-817  41.15,109.25 0 top  (outside the outline)
C1  47.62,184.05 90 top  (outside the outline)
C2  47.5,179.73 90 top  (outside the outline)
C3  1.14,27.08 0 top  (outside the outline)
C3-4.7N  38.86,95.15 0 top  (outside the outline)
C3-4.7N1  -0.76,-184 0 top  (outside the outline)
C4  46.23,179.73 90 top  (outside the outline)
C5  1.14,25.55 0 top  (outside the outline)
C6  5.33,-11.91 0 top  (outside the outline)
C7  8.64,-11.91 0 top  (outside the outline)
C8  -0.76,-16.99 0 top  (outside the outline)
C9  79.38,181 270 top  (outside the outline)
C10  42.67,84.86 0 top  (outside the outline)
C11  38.23,82.19 0 top  (outside the outline)
C12  46.86,95.66 0 top  (outside the outline)
C13  49.15,95.66 0 top  (outside the outline)
C14  40.56,176.58 0 top  (outside the outline)
C15  -0.76,-149.83 0 top  (outside the outline)
C16  -0.76,-152.5 0 top  (outside the outline)
C17  1.52,-72.87 0 top  (outside the outline)
C18  -1.4,-75.54 0 top  (outside the outline)
C19  1.52,-81.13 0 top  (outside the outline)
C20  -1.4,-83.79 0 top  (outside the outline)
C21  1.52,-89.38 0 top  (outside the outline)
C22  -1.4,-92.05 0 top  (outside the outline)
C23  1.52,-97.64 0 top  (outside the outline)
C24  -1.4,-100.3 0 top  (outside the outline)
C25  -0.76,-172.82 0 top  (outside the outline)
C203  -0.76,-29.06 0 top  (outside the outline)
C204  2.54,-29.06 0 top  (outside the outline)
J1  43.31,56.67 0 top  (outside the outline)
J2  -0.25,-130.78 0 top  (outside the outline)
J3  40.77,121.69 0 top  (outside the outline)
J7  9.91,49.68 0 top  (outside the outline)
J301  43.31,61.87 0 top  (outside the outline)
J-TAG/UPDI  41.53,76.73 0 top  (outside the outline)
JP1  -0.76,-70.08 0 top  (outside the outline)
JP2  9.02,40.28 0 top  (outside the outline)
JP3  -0.76,-78.33 0 top  (outside the outline)
JP4  9.02,33.17 0 top  (outside the outline)
JP5  -0.76,-86.59 0 top  (outside the outline)
JP6  -0.76,-94.84 0 top  (outside the outline)
JP7  -0.76,-103.1 0 top  (outside the outline)
JP8  -0.76,-106.65 0 top  (outside the outline)
JP9  -0.76,-110.21 0 top  (outside the outline)
JP10  -0.76,-113.77 0 top  (outside the outline)
JP11  -0.76,-117.32 0 top  (outside the outline)
JP12  -0.76,-120.88 0 top  (outside the outline)
JP13  -0.76,-124.43 0 top  (outside the outline)
JP14  -0.89,-155.55 0 top  (outside the outline)
JP15  -0.76,-158.34 0 top  (outside the outline)
MK1  -0.63,-6.58 0 top  (outside the outline)
R1  2.54,-16.99 0 top  (outside the outline)
R1-100K  47.75,99.47 0 top  (outside the outline)
R1-100K1  -0.76,-181.33 0 top  (outside the outline)
R2  5.84,-16.99 0 top  (outside the outline)
R3  9.14,-16.99 0 top  (outside the outline)
R3-39R  43.31,95.15 0 top  (outside the outline)
R3-39R1  -0.76,-186.66 0 top  (outside the outline)
R4  -0.76,-19.66 0 top  (outside the outline)
R5  -0.76,-175.74 0 top  (outside the outline)
R6  -0.76,-178.66 0 top  (outside the outline)
R_SENSE  22.73,46.63 0 top  (outside the outline)
RESET  40.64,114.83 0 top  (outside the outline)
S1  3.56,35.33 0 top  (outside the outline)
SJ1  0.38,-137.64 0 top  (outside the outline)
SJ2  0.38,-141.83 0 top  (outside the outline)
SJ3  0.38,-163.3 0 top  (outside the outline)
U1  29.84,49.94 0 top  (outside the outline)
U2  1.27,-13.56 0 top  (outside the outline)
U3  1.27,-34.26 0 top  (outside the outline)
U4  68.96,183.67 0 top  (outside the outline)
U5  1.27,-46.96 0 top  (outside the outline)
U6  1.27,-59.66 0 top  (outside the outline)
U7  -1.52,-72.87 0 top  (outside the outline)
U8  -1.52,-81.13 0 top  (outside the outline)
U9  -1.52,-89.38 0 top  (outside the outline)
U10  -1.52,-97.64 0 top  (outside the outline)
U11  -0.38,-167.87 0 top  (outside the outline)
U205  -0.13,-24.61 0 top  (outside the outline)
U$1  3.3,29.74 0 top  (outside the outline)
U$4  53.98,181.89 0 top  (outside the outline)
U$7  [ADAFRUIT_3.5MM]  54.1,187.73 0 top  (outside the outline)
X1  0.51,-145.52 0 top  (outside the outline)
X2  47.62,177.06 0 top  (outside the outline)
X4  75.44,177.32 180 bottom  (outside the outline)

### Tracks (layer width: path | path; a pad name or v marks a point on that pad's centre or on a via)
3V_LD_SW  (3 unrouted)
3V_LD_SW1  (3 unrouted)
3V_LD_SW2  (3 unrouted)
3V_LD_SW3  (3 unrouted)
3V_LD_SW4  (3 unrouted)
!RESET  (2 unrouted)
+3V3  (1 unrouted)
+3V3_ATT  (6 unrouted)
+3V3_BARO  (3 unrouted)
+3V3_DTR  (6 unrouted)
+3V3_DTR0  (4 unrouted)
+3V3_IMU  (4 unrouted)
+3V3_MIC  (4 unrouted)
+3V3_RFM  (2 unrouted)
+3V3_SAM  (6 unrouted)
AREF  (1 unrouted)
AT_RESET  (2 unrouted)
AT_UPDI  (2 unrouted)
ATT_INT  (2 unrouted)
BUS0_AIN0  (2 unrouted)
BUS0_GPIO0  (2 unrouted)
BUS0_GPIO1  (1 unrouted)
BUS0_SERCOM_P0  (1 unrouted)
BUS0_SERCOM_P1  (1 unrouted)
BUS0_SERCOM_P2  (1 unrouted)
BUS0_SERCOM_P3  (1 unrouted)
BUS1_SERCOM_P0  (3 unrouted)
BUS1_SERCOM_P1  (3 unrouted)
BUS2_AIN0  (1 unrouted)
BUS2_AIN1  (1 unrouted)
BUS2_GPIO0  (1 unrouted)
BUS2_GPIO1  (1 unrouted)
BUS2_SERCOM_P0  (1 unrouted)
BUS2_SERCOM_P1  (1 unrouted)
BUS2_SERCOM_P2  (1 unrouted)
BUS2_SERCOM_P3  (1 unrouted)
BUS3_AIN0  (1 unrouted)
BUS3_AIN1  (1 unrouted)
BUS3_GPIO0  (1 unrouted)
BUS3_GPIO1  (1 unrouted)
BUS3_SERCOM_P0  (1 unrouted)
BUS3_SERCOM_P1  (1 unrouted)
BUS3_SERCOM_P2  (1 unrouted)
BUS3_SERCOM_P3  (1 unrouted)
D_N  (1 unrouted)
D_P  (1 unrouted)
DTR_DETECT_IN  (1 unrouted)
DTR_DETECT_OUT  (1 unrouted)
EN_BARO  (1 unrouted)
EN_IMU  (1 unrouted)
EN_MEAS  (1 unrouted)
EN_MIC  (1 unrouted)
EN_RADIO  (2 unrouted)
GND  (68 unrouted)
  pour Bottom: -1.27,22.89 -1.27,-1.24 16.51,-1.24 16.51,22.89
  pour Top: -2.54,24.16 -2.54,-2.51 17.78,-2.51 17.78,22.89 17.78,24.16
IN+  (3 unrouted)
IN-  (2 unrouted)
LORA_CS  (1 unrouted)
LORA_IRQ  (1 unrouted)
LORA_MISO  (1 unrouted)
LORA_MOSI  (1 unrouted)
LORA_RST  (1 unrouted)
LORA_SCK  (1 unrouted)
MASTER_I2C_SCL  (2 unrouted)
MASTER_I2C_SDA  (2 unrouted)
MEAS_BARO  (1 unrouted)
MEAS_IMU  (1 unrouted)
MEAS_MIC  (1 unrouted)
MEAS_RFM  (1 unrouted)
MEAS_SAM  (1 unrouted)
N0  (3 unrouted)
N1  (3 unrouted)
N2  (3 unrouted)
N3  (3 unrouted)
N4  (3 unrouted)
N$1  (1 unrouted)
N$2  (1 unrouted)
N$3  (1 unrouted)
N$4  (6 unrouted)
N$5  (2 unrouted)
N$6  (1 unrouted)
N$7  (2 unrouted)
N$8  (1 unrouted)
N$9  (2 unrouted)
N$10  (1 unrouted)
N$11  (1 unrouted)
N$12  (1 unrouted)
N$13  (1 unrouted)
N$14  (1 unrouted)
N$15  (1 unrouted)
N$16  (5 unrouted)
N$18  (1 unrouted)
N$19  (1 unrouted)
N$20  (1 unrouted)
N$21  (1 unrouted)
N$22  (2 unrouted)
N$23  (2 unrouted)
N$24  (3 unrouted)
N$25  (2 unrouted)
N$26  (1 unrouted)
OUT  (1 unrouted)
SWCLK  (1 unrouted)
SWDIO  (1 unrouted)
V_SENSE_IN  (1 unrouted)
V_SENSE_OUT  (1 unrouted)

### Text on the board
tPlace: 10 | ~ | ~ | 9 | 6 | ~ | 5 | SCL | SDA | BAT | En | USB | 13 | 12 | 11 | ~ | #13 | RFM9x LoRa | RFM9x / LoRa | Reset | adafruit! | CHG | Feather M0 | RST | 3V | ARf | GND | A0 | A1 | A2 | A3 | A4 | A5 | SCK | MOS | MIS | RX0 | TX1 | io1 | Oct. 2019 | Eve's MEMS Microphone Board v2